# Altium schematic sheet top_sheet.SchDoc
size A4; SheetNumber: 1; SheetTotal: 6
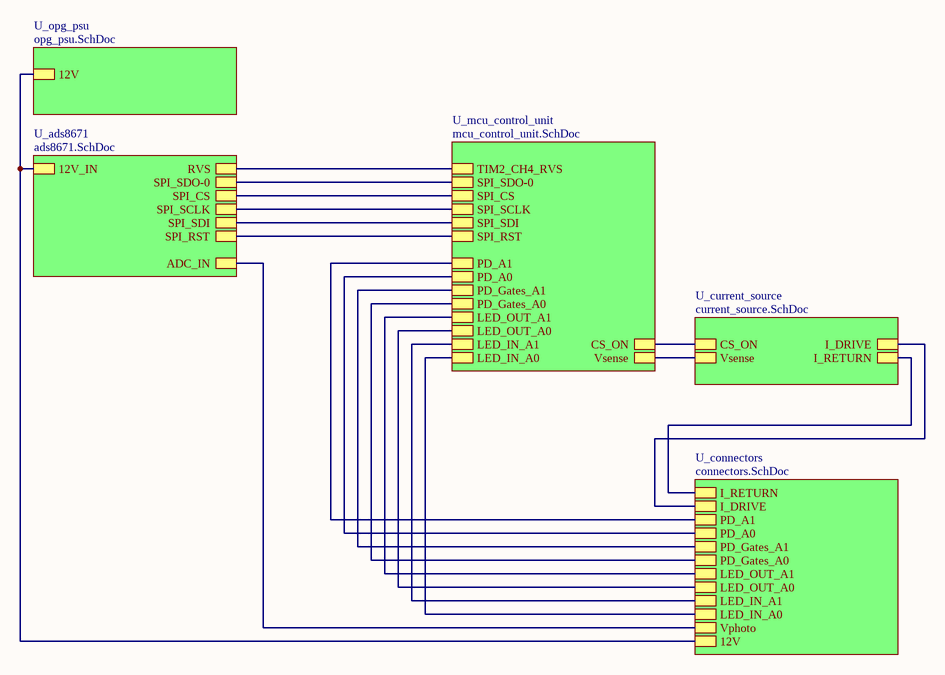
[diagram p0: top_sheet.SchDoc]

## Sub-sheets
U_ads8671 = ads8671.SchDoc: SPI_SDO-0, SPI_SCLK, SPI_CS, SPI_SDI, SPI_RST, 12V_IN, RVS, ADC_IN
U_connectors = connectors.SchDoc: I_RETURN, I_DRIVE, PD_A1, PD_Gates_A1, PD_Gates_A0, LED_OUT_A1, LED_OUT_A0, LED_IN_A1, LED_IN_A0, PD_A0, 12V, Vphoto
U_current_source = current_source.SchDoc: I_DRIVE, I_RETURN, CS_ON, Vsense
U_mcu_control_unit = mcu_control_unit.SchDoc: SPI_SDO-0, SPI_CS, SPI_SCLK, SPI_SDI, SPI_RST, CS_ON, PD_A1, PD_A0, PD_Gates_A1, PD_Gates_A0, LED_OUT_A1, LED_OUT_A0, LED_IN_A1, LED_IN_A0, Vsense, TIM2_CH4_RVS
U_opg_psu = opg_psu.SchDoc: 12V

## Nets
(unnamed): sheet U_ads8671/SPI_SDO-0, sheet U_mcu_control_unit/SPI_SDO-0
(unnamed): sheet U_ads8671/SPI_SCLK, sheet U_mcu_control_unit/SPI_SCLK
(unnamed): sheet U_ads8671/SPI_CS, sheet U_mcu_control_unit/SPI_CS
(unnamed): sheet U_ads8671/SPI_SDI, sheet U_mcu_control_unit/SPI_SDI
(unnamed): sheet U_ads8671/SPI_RST, sheet U_mcu_control_unit/SPI_RST
(unnamed): sheet U_ads8671/12V_IN, sheet U_opg_psu/12V, sheet U_connectors/12V
(unnamed): sheet U_ads8671/RVS, sheet U_mcu_control_unit/TIM2_CH4_RVS
(unnamed): sheet U_ads8671/ADC_IN, sheet U_connectors/Vphoto
(unnamed): sheet U_current_source/I_DRIVE, sheet U_connectors/I_DRIVE
(unnamed): sheet U_current_source/I_RETURN, sheet U_connectors/I_RETURN
(unnamed): sheet U_current_source/CS_ON, sheet U_mcu_control_unit/CS_ON
(unnamed): sheet U_current_source/Vsense, sheet U_mcu_control_unit/Vsense
(unnamed): sheet U_connectors/PD_A1, sheet U_mcu_control_unit/PD_A1
(unnamed): sheet U_connectors/PD_Gates_A1, sheet U_mcu_control_unit/PD_Gates_A1
(unnamed): sheet U_connectors/PD_Gates_A0, sheet U_mcu_control_unit/PD_Gates_A0
(unnamed): sheet U_connectors/LED_OUT_A1, sheet U_mcu_control_unit/LED_OUT_A1
(unnamed): sheet U_connectors/LED_OUT_A0, sheet U_mcu_control_unit/LED_OUT_A0
(unnamed): sheet U_connectors/LED_IN_A1, sheet U_mcu_control_unit/LED_IN_A1
(unnamed): sheet U_connectors/LED_IN_A0, sheet U_mcu_control_unit/LED_IN_A0
(unnamed): sheet U_connectors/PD_A0, sheet U_mcu_control_unit/PD_A0